# Altium schematic sheet UPS_controller.SchDoc
size A4
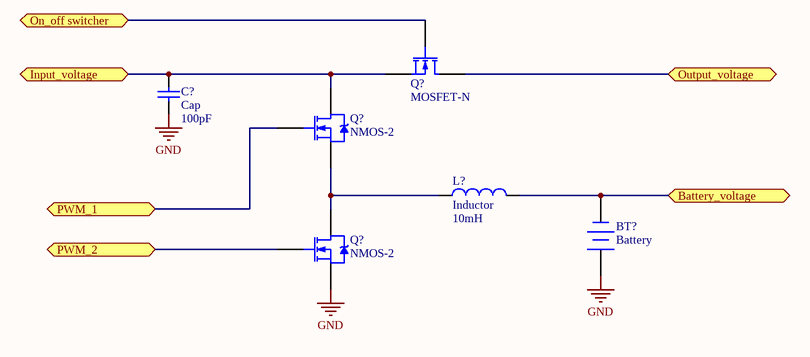
[diagram p0: UPS_controller.SchDoc]

## Parts
(Parts that share a designator on the sheet are numbered #1, #2 ... from top to bottom, then left to right.)
BT?  Battery  [BAT-2]
C?  Cap  value 100pF  [RAD-0.3]
L?  Inductor  value 10mH  [0402-A]
Q?#1  MOSFET-N  [E3]
Q?#2  NMOS-2  [TO-220AB]
Q?#3  NMOS-2  [TO-220AB]

## Ports
Battery_voltage, Input_voltage, On_off switcher, Output_voltage, PWM_1, PWM_2

## Nets
GND: BT?.1(+) C?.1 Q?#3.3(S)
Battery_voltage: BT?.2(-) L?.2 ; port Battery_voltage
Input_voltage: C?.2 Q?#1.3(S) Q?#2.2(D) ; port Input_voltage
On_off switcher: Q?#1.2(G) ; port On_off switcher
Output_voltage: Q?#1.1(D) ; port Output_voltage
PWM_1: Q?#2.1(G) ; port PWM_1
PWM_2: Q?#3.1(G) ; port PWM_2
NetL?_1: L?.1 Q?#2.3(S) Q?#3.2(D)

## Library data of the parts
BT? = Battery: Multicell Battery; Published: 24-Mar-1999; LatestRevisionDate: 17-Jul-2002; LatestRevisionNote: Re-released for DXP Platform.; PackageReference: BAT-2; Publisher: Altium Limited; PackageDescription: Battery; 2 Leads
C? = Cap: Capacitor; Published: 8-Jun-2000; LatestRevisionDate: 17-Jul-2002; LatestRevisionNote: Re-released for DXP Platform.; PackageReference: RAD-0.3; Publisher: Altium Limited; PackageDescription: Radial Cap, Thru-Hole; 2 Leads; 0.3 in Pin Spacing
L? = Inductor: Code_IEC: 1005; Published: 8-Jun-2000; LatestRevisionDate: 29-May-2009; LatestRevisionNote: IPC-7351 Footprint Added.; PackageReference: 0402-A; Publisher: Altium Limited; PackageDescription: Chip Inductor; Code_JEITA: 0402
Q?#1 = MOSFET-N: N-Channel MOSFET; Published: 8-Jun-2000; LatestRevisionDate: 17-Jul-2002; LatestRevisionNote: Re-released for DXP Platform.; PackageVersion: 1995/1996; PackageReference: E3; Publisher: Altium Limited; PackageDescription: TO, Flat Index; 3 In-Line, Axial Leads; Body Dia. 4.6mm; Lead Dia. 0.5 mm (max)
Q?#2 Q?#3 = NMOS-2: N-Channel Power MOSFET; Note: Pin 2 is electrically connected to pin 4.; Published: 8-Jun-2000; LatestRevisionDate: 17-Jul-2002; LatestRevisionNote: Re-released for DXP Platform.; DatasheetVersion: PD-9.814; PackageVersion: Feb-1997; PackageReference: TO-220AB; Publisher: Altium Limited; PackageDescription: TO, Thru-Hole, Vertical, Heatsink Mounted; 3 In-Line Leads; Pitch 2.54 mm; ComponentLink1Description: Manufacturer Link; ComponentLink1URL: http://www.irf.com/